# EAGLE design untitled (EAGLE 8.1.0)
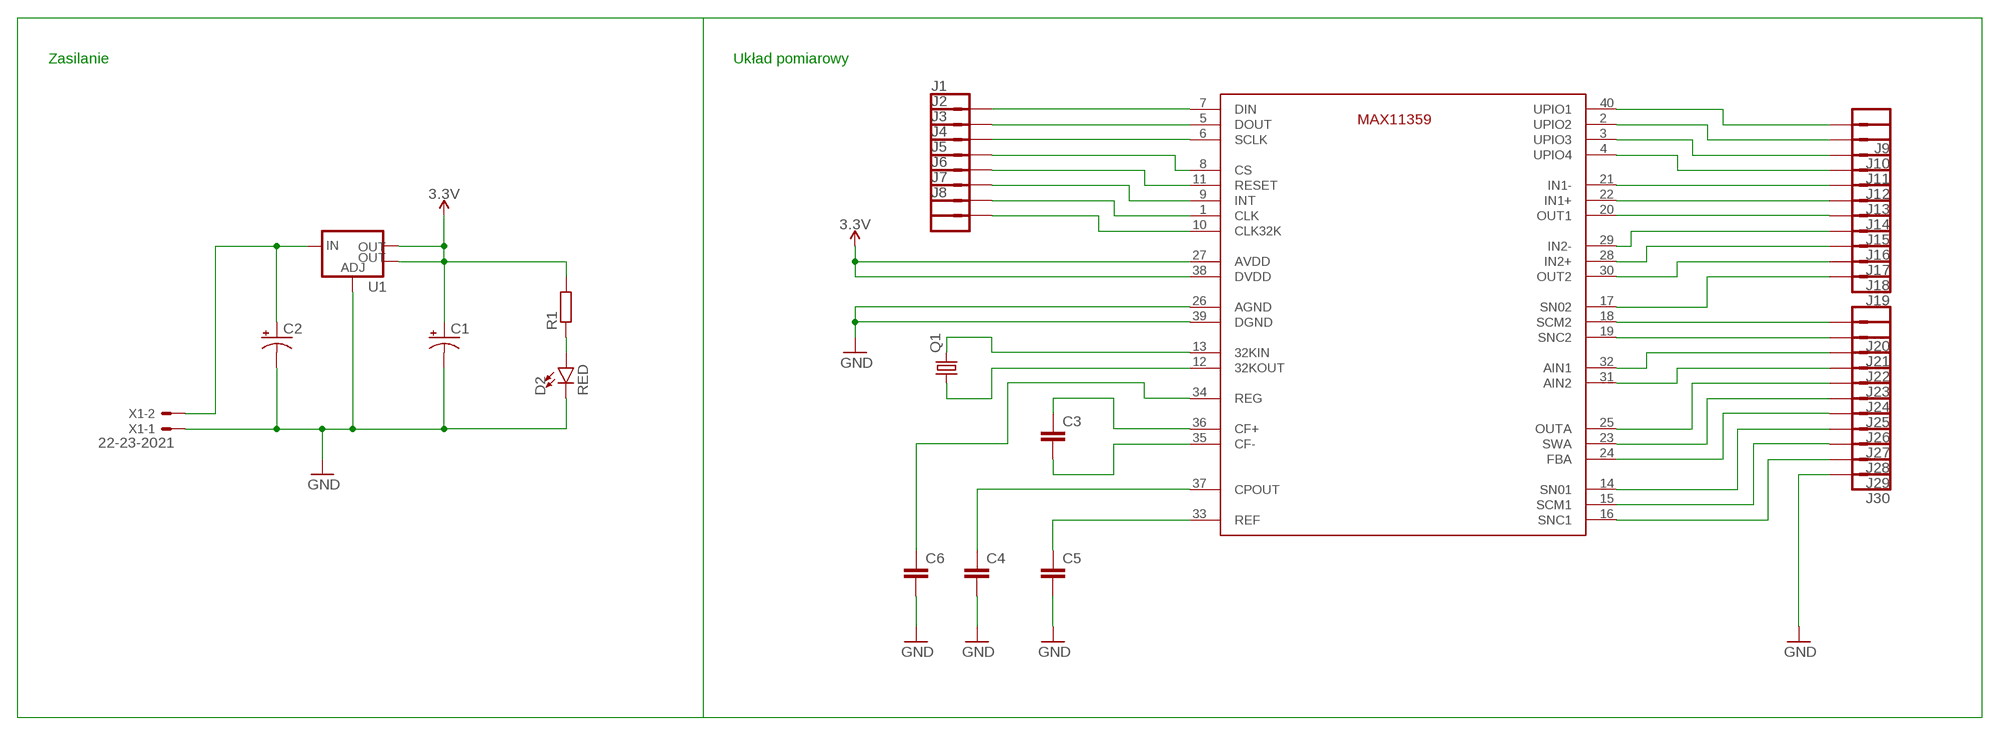
[diagram p0: schematic, sheet 1]

## Parts
C1  CPOL-US140CLH-1010  [140CLH-1010]
C2  CPOL-US140CLH-1010  [140CLH-1010]
C3  C-EUC0805  [C0805]
C4  C-EUC0805  [C0805]
C5  C-EUC0805  [C0805]
C6  C-EUC0805  [C0805]
D2  RED  LED-RED1206  [LED-1206]
J1  CONN_01  [1X01]
J2  CONN_01  [1X01]
J3  CONN_01  [1X01]
J4  CONN_01  [1X01]
J5  CONN_01  [1X01]
J6  CONN_01  [1X01]
J7  CONN_01  [1X01]
J8  CONN_01  [1X01]
J9  CONN_01  [1X01]
J10  CONN_01  [1X01]
J11  CONN_01  [1X01]
J12  CONN_01  [1X01]
J13  CONN_01  [1X01]
J14  CONN_01  [1X01]
J15  CONN_01  [1X01]
J16  CONN_01  [1X01]
J17  CONN_01  [1X01]
J18  CONN_01  [1X01]
J19  CONN_01  [1X01]
J20  CONN_01  [1X01]
J21  CONN_01  [1X01]
J22  CONN_01  [1X01]
J23  CONN_01  [1X01]
J24  CONN_01  [1X01]
J25  CONN_01  [1X01]
J26  CONN_01  [1X01]
J27  CONN_01  [1X01]
J28  CONN_01  [1X01]
J29  CONN_01  [1X01]
J30  CONN_01  [1X01]
Q1  CRYSTALHC49UP  [HC49UP]
R1  R-EU_M0805  [M0805]
U1  V_REG_LM1117SOT223  [SOT223]
U$1  MAX11359A  [TQFN]
X1  22-23-2021  [22-23-2021]

## Nets
3.3V: C1.+ R1.2 U1.2(OUT) U1.4(OUT) U$1.27(AVDD) U$1.38(DVDD)
GND: C1.- C2.- C4.2 C5.2 C6.2 D2.C J30.1 U1.1(ADJ) U$1.26(AGND) U$1.39(DGND) X1.1
N$1: J1.1 U$1.7(DIN)
N$2: J2.1 U$1.5(DOUT)
N$3: J3.1 U$1.6(SCLK)
N$4: J4.1 U$1.8(CS)
N$5: J5.1 U$1.11(RESET)
N$6: J6.1 U$1.9(INT)
N$7: J7.1 U$1.1(CLK)
N$8: J8.1 U$1.10(CLK32K)
N$9: C3.1 U$1.36(CF+)
N$10: C3.2 U$1.35(CF-)
N$11: C4.1 U$1.37(CPOUT)
N$12: C5.1 U$1.33(REF)
N$13: D2.A R1.1
N$14: C2.+ U1.3(IN) X1.2
N$15: J10.1 U$1.2(UPIO2)
N$16: J11.1 U$1.3(UPIO3)
N$17: J12.1 U$1.4(UPIO4)
N$18: Q1.2 U$1.13(32KIN)
N$19: Q1.1 U$1.12(32KOUT)
N$20: C6.1 U$1.34(REG)
N$21: J9.1 U$1.40(UPIO1)
N$22: J13.1 U$1.21(IN1-)
N$23: J14.1 U$1.22(IN1+)
N$24: J15.1 U$1.20(OUT1)
N$25: J16.1 U$1.29(IN2-)
N$26: J17.1 U$1.28(IN2+)
N$27: J18.1 U$1.30(OUT2)
N$28: J19.1 U$1.17(SN02)
N$29: J20.1 U$1.18(SCM2)
N$30: J21.1 U$1.19(SNC2)
N$31: J22.1 U$1.32(AIN1)
N$32: J23.1 U$1.31(AIN2)
N$33: J24.1 U$1.25(OUTA)
N$34: J25.1 U$1.23(SWA)
N$35: J26.1 U$1.24(FBA)
N$36: J27.1 U$1.14(SN01)
N$37: J28.1 U$1.15(SCM1)
N$38: J29.1 U$1.16(SNC1)

## Notes on the sheet
- Zasilanie | Układ pomiarowy

## Library data of the parts
C1 C2 = adafruit:CPOL-US: POLARIZED CAPACITOR, American symbol
C3-C6 = resistor:C-EU: CAPACITOR, European symbol
D2 = SparkFun-LED:LED-RED: Red SMD LED Used in manufacturing of most products at SparkFun Packages: 0603 - SMD 0603 package [Product Link] <http://docs.avagotech.com/docs/AV02-0551EN> 0603 SMART - SMD 0603 SMART package ( more efficient and expensive)[Product Link] <http://www.osram-os.com/Graphics/XPic2/00077099_0.pdf> 1206 - SMD1206 package [Product Link] <https://www.sparkfun.com/datasheets/DevTools/LilyPad/Q150OVS4.pdff> SparkFun Products: Pro Mini 328 -5V <https://www.sparkfun.com/products/821> RedBoard <https://www.sparkfun.com/products/12757> IOIO-OTG <https://www.sparkfun.com/products/13613>; PROD_ID: DIO-09912
J1-J30 = SparkFun-Connectors:CONN_01: Single connection point. Often used as Generic Header-pin footprint for 0.1 inch spaced/style header connections On any of the 0.1 inch spaced packages, you can populate with these: Break Away Headers - Straight <https://www.sparkfun.com/products/116> (PRT-00116) Break Away Male Headers - Right Angle <https://www.sparkfun.com/products/553> (PRT-00553) Female Headers <https://www.sparkfun.com/products/115> (PRT-00115) Break Away Headers - Machine Pin <https://www.sparkfun.com/products/117> (PRT-00117) Break Away Female Headers - Swiss Machine Pin <https://www.sparkfun.com/products/743> (PRT-00743) This device is also useful as a general connection point to wire up your design to another part of your project. Our various solder wires solder well into these plated through hole pads. Hook-Up Wire - Assortment (Stranded, 22 AWG) <https://www.sparkfun.com/products/11375> (PRT-11375) Hook-Up Wire - Assortment (Solid Core, 22 AWG) <https://www.sparkfun.com/products/11367> (PRT-11367) View the entire wire category on our website here <https://www.sparkfun.com/categories/141> Special notes: SMTSO-256-ET is a "flush mount" nut for a 4-40 screw. We mostly use this on specialty testbeds; it is a nice way to connect hardware to your PCB at an adjustable hieght. Also note, the SNAP packages are for using a snappable style connector. We sell a baggie of snaps and they are also used on two LilyPad designs: Snap Assortment - 30 pack (male and female) <https://www.sparkfun.com/products/11347> (DEV-11347) LilyPad Arduino SimpleSnap <https://www.sparkfun.com/products/10941> (DEV-10941) LilyPad SimpleSnap Protoboard <https://www.sparkfun.com/products/10940> (DEV-10940)
Q1 = adafruit:CRYSTAL: CRYSTAL; OC_FARNELL: unknown; OC_NEWARK: unknown
R1 = resistor:R-EU_: RESISTOR, European symbol
U1 = SparkFun-IC-Power:V_REG_LM1117: Voltage Regulator LM1117 Standard adjustable voltage regulator but in SMD form. Spark Fun Electronics SKU : COM-00595; PROD_ID: VREG-08170
U$1 = max11359:MAX11359A
X1 = con-molex:22-23-2021: .100" (2.54mm) Center Header - 2 Pin; MF: MOLEX; MPN: 22-23-2021; OC_FARNELL: 1462926; OC_NEWARK: 25C3832

## Board
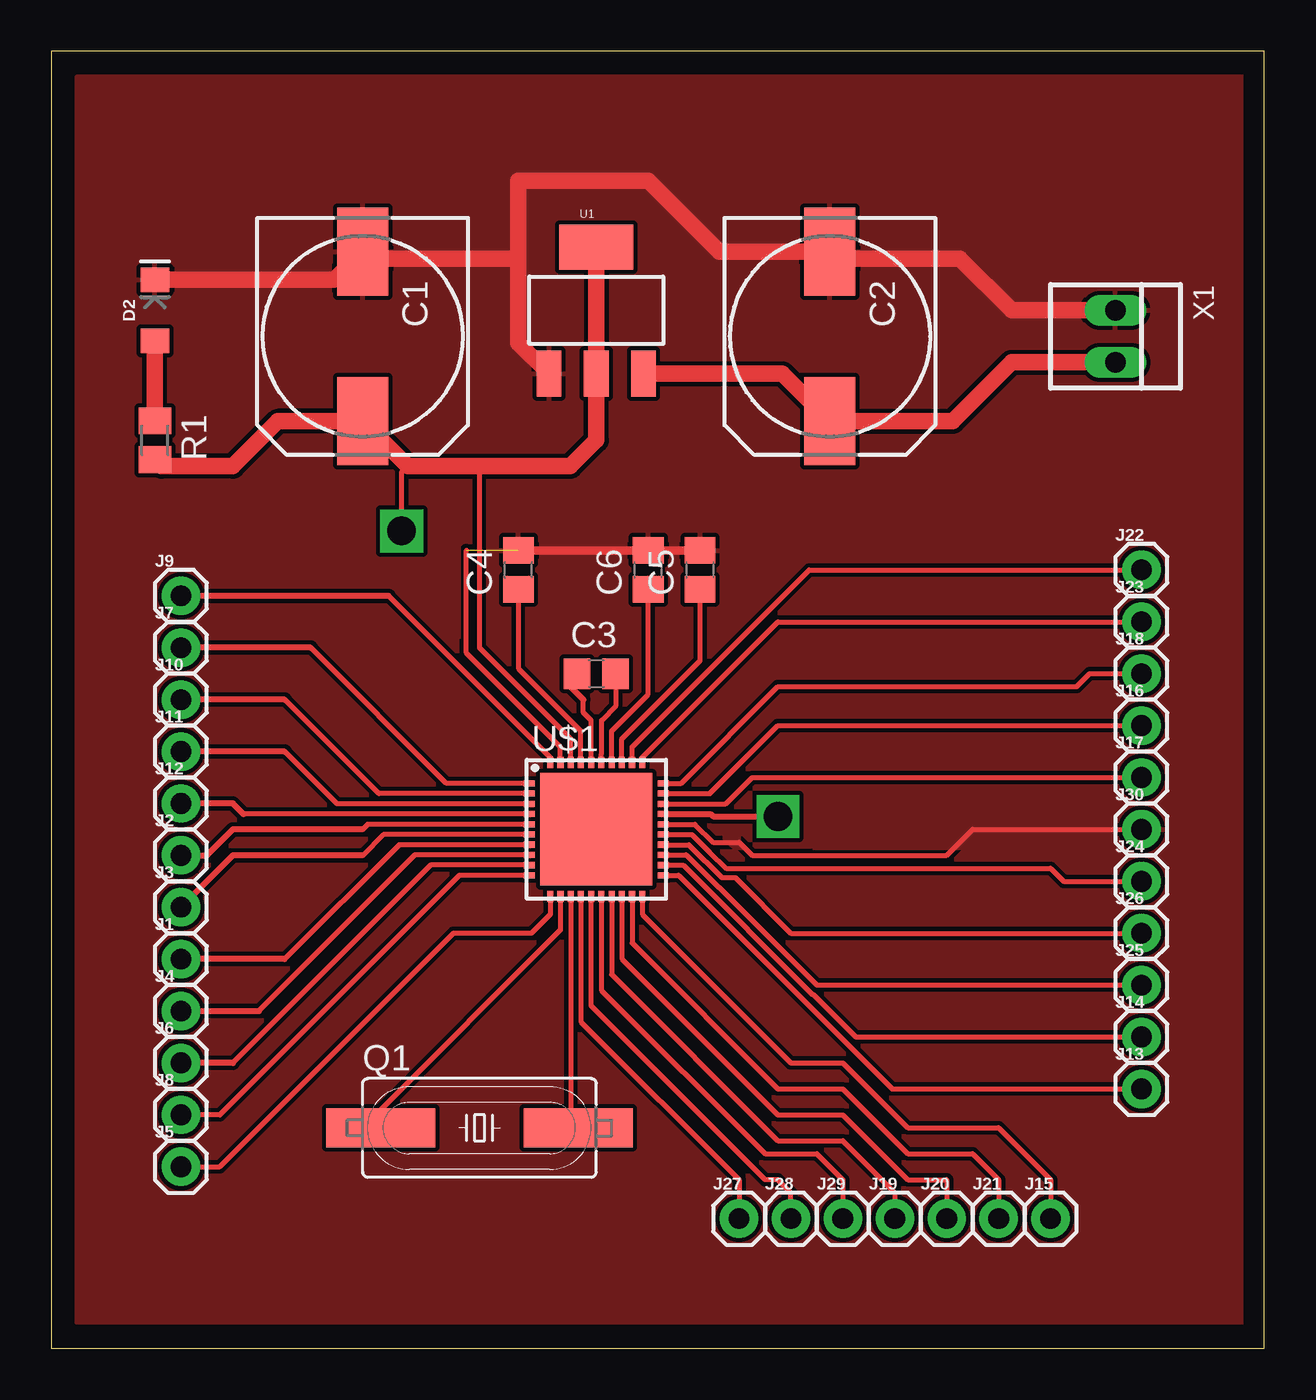
[diagram p1: board, top side]
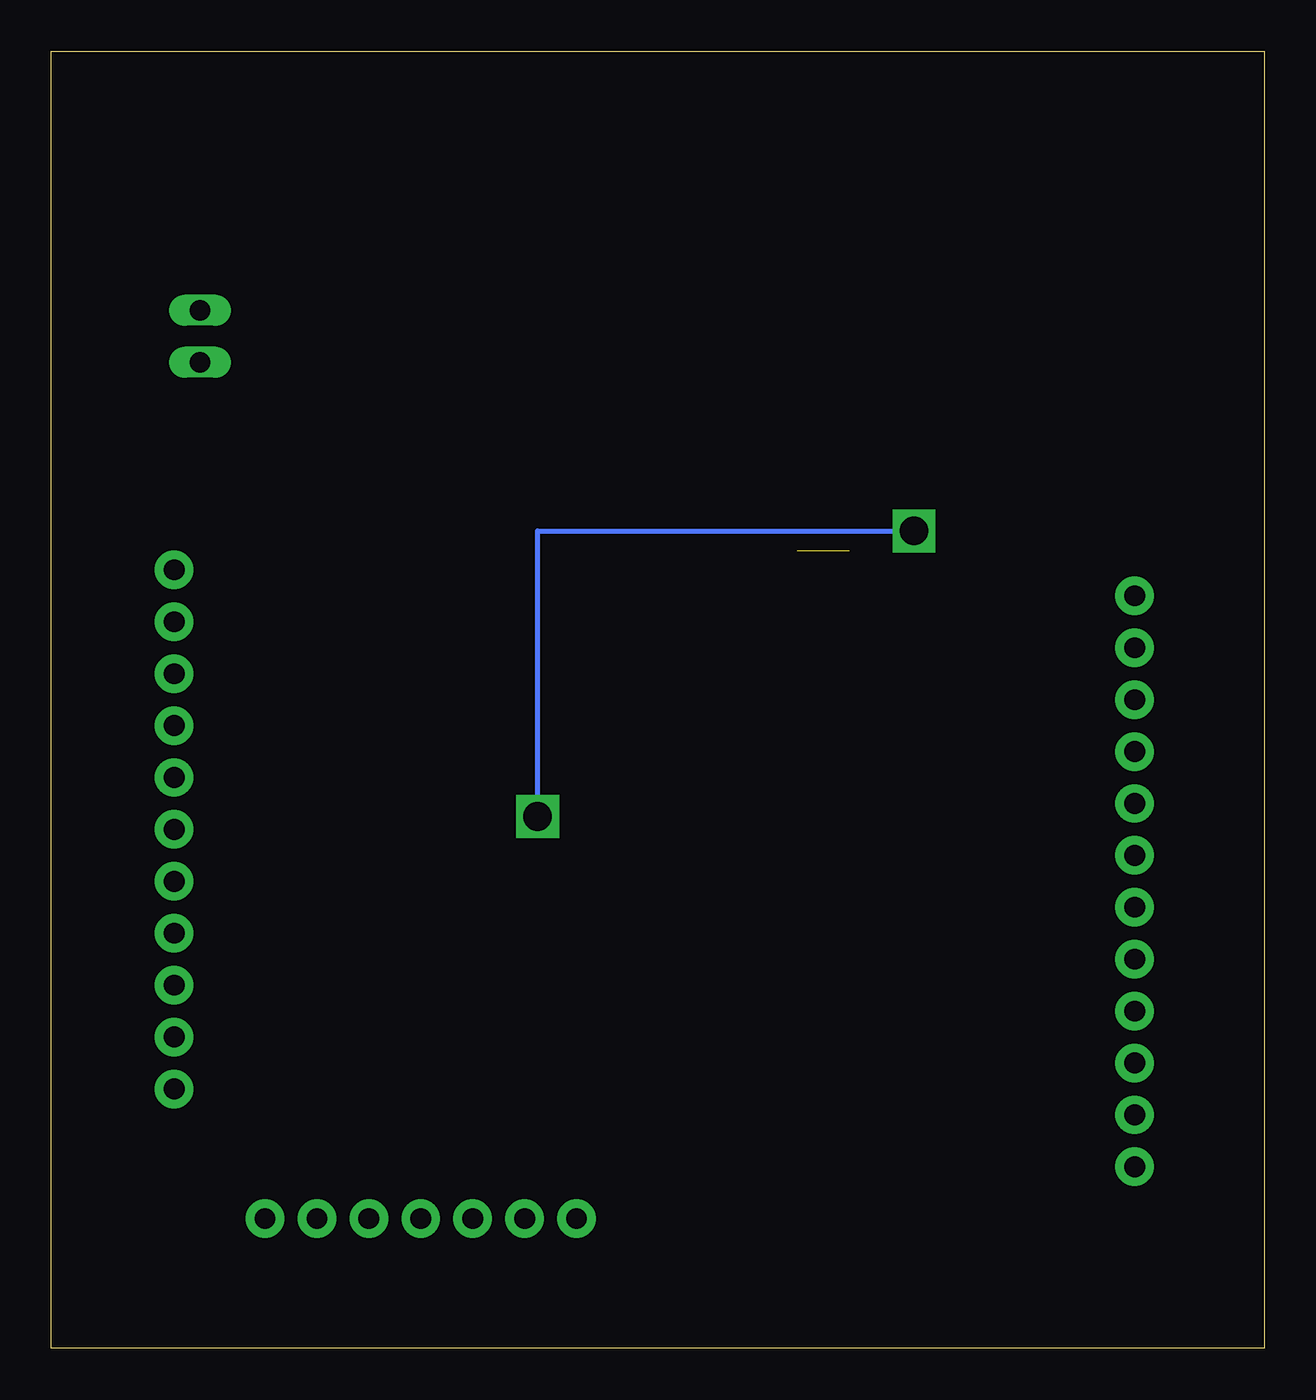
[diagram p2: board, bottom side, seen from below]

Size 59.36 x 63.49 mm. Coordinates in mm from the lower left corner, seen from the top.
Outline: 0,0 59.36,0 59.36,63.49 0,63.49 0,0
Copper layers (1*16): Top 0.035mm / dielectric 1.5mm / Bottom 0.035mm
Design rules "default": minimum track width 10mil, minimum drill 24mil, track to track 8mil, track to pad 8mil, pad to pad 8mil, via to via 8mil, smd to smd 8mil, copper to edge 40mil, drill to drill 8mil, minimum pad ring 10mil, minimum via ring 8mil, stop-mask expansion 4mil, vias tented up to drill 0mil, thermal gap 10mil

### Footprints (pad centres in the part's own frame; a part is rotated, then mirrored left to right if it is on the bottom)
140CLH-1010 = smd 4.3 x 2.5: + 4.15,0; - -4.15,0
C0805 = smd 1.3 x 1.5: 1 -0.95,0; 2 0.95,0
LED-1206 = smd 1.2 x 1.4: A -1.5,0; C 1.5,0
1X01 = drill 1.016 pad 1.88: 1 0,0
HC49UP = smd 5.334 x 1.93: 1 -4.826,0; 2 4.826,0
M0805 = smd 1.3 x 1.6: 1 -0.95,0; 2 0.95,0
SOT223 = smd 1.219 x 2.235: 1 -2.311,-3.099; 2 0,-3.099; 3 2.311,-3.099 | smd 3.6 x 2.2: 4 0,3.099
TQFN = smd 0.55 x 0.3: 1 0.535,-1.56; 2 0.535,-2.06; 3 0.535,-2.56; 4 0.535,-3.06; 5 0.535,-3.56; 6 0.535,-4.06; 7 0.535,-4.56; 8 0.535,-5.06; 9 0.535,-5.56; 10 0.535,-6.06; 21 7.085,-6.06; 22 7.085,-5.56; 23 7.085,-5.06; 24 7.085,-4.56; 25 7.085,-4.06; 26 7.085,-3.56; 27 7.085,-3.06; 28 7.085,-2.56; 29 7.085,-2.06; 30 7.085,-1.56 | smd 0.3 x 0.55: 11 1.56,-7.085; 12 2.06,-7.085; 13 2.56,-7.085; 14 3.06,-7.085; 15 3.56,-7.085; 16 4.06,-7.085; 17 4.56,-7.085; 18 5.06,-7.085; 19 5.56,-7.085; 20 6.06,-7.085; 31 6.06,-0.535; 32 5.56,-0.535; 33 5.06,-0.535; 34 4.56,-0.535; 35 4.06,-0.535; 36 3.56,-0.535; 37 3.06,-0.535; 38 2.56,-0.535; 39 2.06,-0.535; 40 1.56,-0.535 | smd 5.5 x 5.5: EXP 3.81,-3.81
22-23-2021 = drill 1 long: 1 -1.27,0; 2 1.27,0

### Placement (x,y rotation side)
C1  15.24,49.53 270 top
C2  38.1,49.53 270 top
C3  26.67,33.02 0 top
C4  22.86,38.1 90 top
C5  31.75,38.1 90 top
C6  29.21,38.1 90 top
D2  5.08,50.8 90 top
J1  6.35,19.05 0 top
J2  6.35,24.13 0 top
J3  6.35,21.59 0 top
J4  6.35,16.51 0 top
J5  6.35,8.89 0 top
J6  6.35,13.97 0 top
J7  6.35,34.29 0 top
J8  6.35,11.43 0 top
J9  6.35,36.83 0 top
J10  6.35,31.75 0 top
J11  6.35,29.21 0 top
J12  6.35,26.67 0 top
J13  53.34,12.7 0 top
J14  53.34,15.24 0 top
J15  48.9,6.35 0 top
J16  53.34,30.48 0 top
J17  53.34,27.94 0 top
J18  53.34,33.02 0 top
J19  41.27,6.35 0 top
J20  43.81,6.35 0 top
J21  46.35,6.35 0 top
J22  53.34,38.1 0 top
J23  53.34,35.56 0 top
J24  53.34,22.86 0 top
J25  53.34,17.78 0 top
J26  53.34,20.32 0 top
J27  33.66,6.35 0 top
J28  36.2,6.35 0 top
J29  38.73,6.35 0 top
J30  53.34,25.4 0 top
Q1  20.95,10.79 0 top
R1  5.08,44.45 270 top
U1  26.67,50.8 0 top
U$1  22.86,29.21 0 top
X1  52.07,49.53 270 top

### Tracks (layer width: path | path; a pad name or v marks a point on that pad's centre or on a via)
3.3V  (via drill 1.4)
  Top 0.254: U$1.38 25.42,29.82 20.95,34.29 20.95,43.18 | v17.14,40.01 17.14,42.88 17.44,43.18
  Top 0.305: v35.56,26.04 32.38,26.04 32.27,26.15 U$1.27
  Top 0.406: 5.4,43.18 R1.2
  Top 0.813: U1.4 U1.2 26.67,44.45 25.4,43.18 20.95,43.18 17.44,43.18 C1.+ 11.09,45.38 8.89,43.18 5.4,43.18
  Bottom 0.254: v17.14,40.01 35.56,40.01 v35.56,26.04
GND  (1 unrouted)
  Top 0.254: U$1.39 24.92,29.44 20.32,34.04 20.32,39.05 | U$1.26 31.5,25.65 32.38,24.77 33.66,24.77 34.29,24.13 43.81,24.13 45.09,25.4 J30.1
  Top 0.406: 38.44,53.34 C2.- | C1.- 15.58,53.34 | C4.2 C6.2 C5.2
  Top 0.813: X1.1 46.99,50.8 44.45,53.34 38.44,53.34 | C2.- 32.68,53.68 29.21,57.15 22.86,57.15 22.86,53.34 | 22.86,53.34 22.86,49.2 U1.1 | 22.86,53.34 15.58,53.34 | D2.C 13.86,52.3 C1.-
  pour Top (isolate 0.762): 2.54,61.59 57.78,61.59 57.78,2.54 2.54,2.54
N$1
  Top 0.254: U$1.7 17.03,24.65 11.43,19.05
  Top 0.305: 11.43,19.05 J1.1
N$2
  Top 0.254: U$1.5 15.49,25.65 15.24,25.4
  Top 0.305: J2.1 7.62,24.13 8.89,25.4 15.24,25.4
N$3
  Top 0.254: U$1.6 16.26,25.15 15.24,24.13
  Top 0.305: 15.24,24.13 8.89,24.13 J3.1
N$4
  Top 0.254: 10.16,16.51 17.8,24.15 U$1.8
  Top 0.305: J4.1 10.16,16.51
N$5
  Top 0.254: J5.1 8.26,8.89 19.68,20.32 23.5,20.32 24.42,21.25 U$1.11
N$6
  Top 0.254: U$1.9 18.57,23.65 8.89,13.97
  Top 0.305: 8.89,13.97 J6.1
N$7
  Top 0.254: U$1.1 19.34,27.65 12.7,34.29
  Top 0.305: 12.7,34.29 J7.1
N$8
  Top 0.254: U$1.10 19.98,23.15 8.26,11.43 J8.1
N$9
  Top 0.254: U$1.36 26.42,30.73 26.04,31.11 26.04,31.75
  Top 0.305: 26.04,31.75 25.4,32.38 25.4,32.7 C3.1
N$10
  Top 0.254: C3.2 27.62,31.43 26.93,30.74 26.93,29.11 26.92,29.1 U$1.35
N$11
  Top 0.254: U$1.37 25.92,30.21 22.86,33.27 C4.1
N$12
  Top 0.254: U$1.33 27.92,29.82 31.75,33.66 C5.1
N$13
  Top 0.813: R1.1 D2.A
N$14
  Top 0.813: U1.3 35.78,47.7 C2.+ 44.11,45.38 46.99,48.26 X1.2
N$15
  Top 0.254: U$1.2 16.03,27.15 11.43,31.75
  Top 0.305: 11.43,31.75 J10.1
N$16
  Top 0.254: U$1.3 13.99,26.65 11.43,29.21
  Top 0.305: 11.43,29.21 J11.1
N$17
  Top 0.254: U$1.4 9.41,26.15
  Top 0.305: 9.41,26.15 8.89,26.67 J12.1
N$18
  Top 0.254: U$1.13 25.42,11.16 Q1.2
N$19
  Top 0.254: U$1.12 24.92,20.48 15.88,11.43 15.88,11.05 Q1.1
N$20
  Top 0.254: U$1.34 27.42,30.21 29.21,32 C6.1
N$21
  Top 0.254: U$1.40 24.42,28.92 16.51,36.83
  Top 0.305: 16.51,36.83 J9.1
N$22
  Top 0.254: U$1.21 30.7,23.15 41.15,12.7 J13.1
N$23
  Top 0.254: U$1.22 30.91,23.65 37.24,17.32 37.29,17.32 39.37,15.24 J14.1
N$24
  Top 0.254: U$1.20 28.92,21.25 36.2,13.97 38.73,13.97 41.91,10.79 46.35,10.79 48.9,8.26 J15.1
N$25
  Top 0.254: U$1.29 32.23,27.15 35.56,30.48 J16.1
N$26
  Top 0.254: U$1.28 33,26.65 34.29,27.94 J17.1
N$27
  Top 0.254: U$1.30 30.82,27.65 35.56,32.38 50.16,32.38 50.8,33.02 J18.1
N$28
  Top 0.254: U$1.17 27.42,18.3 35.56,10.16 38.73,10.16 41.27,7.62 J19.1
N$29
  Top 0.254: U$1.18 27.92,19.07 35.56,11.43 38.73,11.43 41.91,8.26 43.81,8.26 J20.1
N$30
  Top 0.254: U$1.19 28.42,19.84 35.56,12.7 38.73,12.7 41.91,9.53 45.09,9.53 46.35,8.26 J21.1
N$31
  Top 0.254: U$1.32 28.42,29.44 37.08,38.1 J22.1
N$32
  Top 0.254: U$1.31 28.92,28.92 35.56,35.56 J23.1
N$33
  Top 0.254: U$1.25 31.35,25.15 32.2,24.31 32.21,24.31 33.02,23.5 48.9,23.5 49.53,22.86 J24.1
N$34
  Top 0.254: U$1.23 31.06,24.15 32.63,22.58 32.66,22.58 37.47,17.78 J25.1
N$35
  Top 0.254: U$1.24 31.21,24.65 32.82,23.04 33.48,23.04 36.2,20.32 J26.1
N$36
  Top 0.254: U$1.14 25.92,15.99 33.66,8.26 J27.1
N$37
  Top 0.254: U$1.15 26.42,16.76 34.92,8.26 35.56,8.26 36.2,7.62 J28.1
N$38
  Top 0.254: U$1.16 26.92,17.53 34.92,9.53 37.47,9.53 38.73,8.26 J29.1
N$39
  pour Top: 1.27,62.23 58.42,62.23 58.42,1.27 1.27,1.27